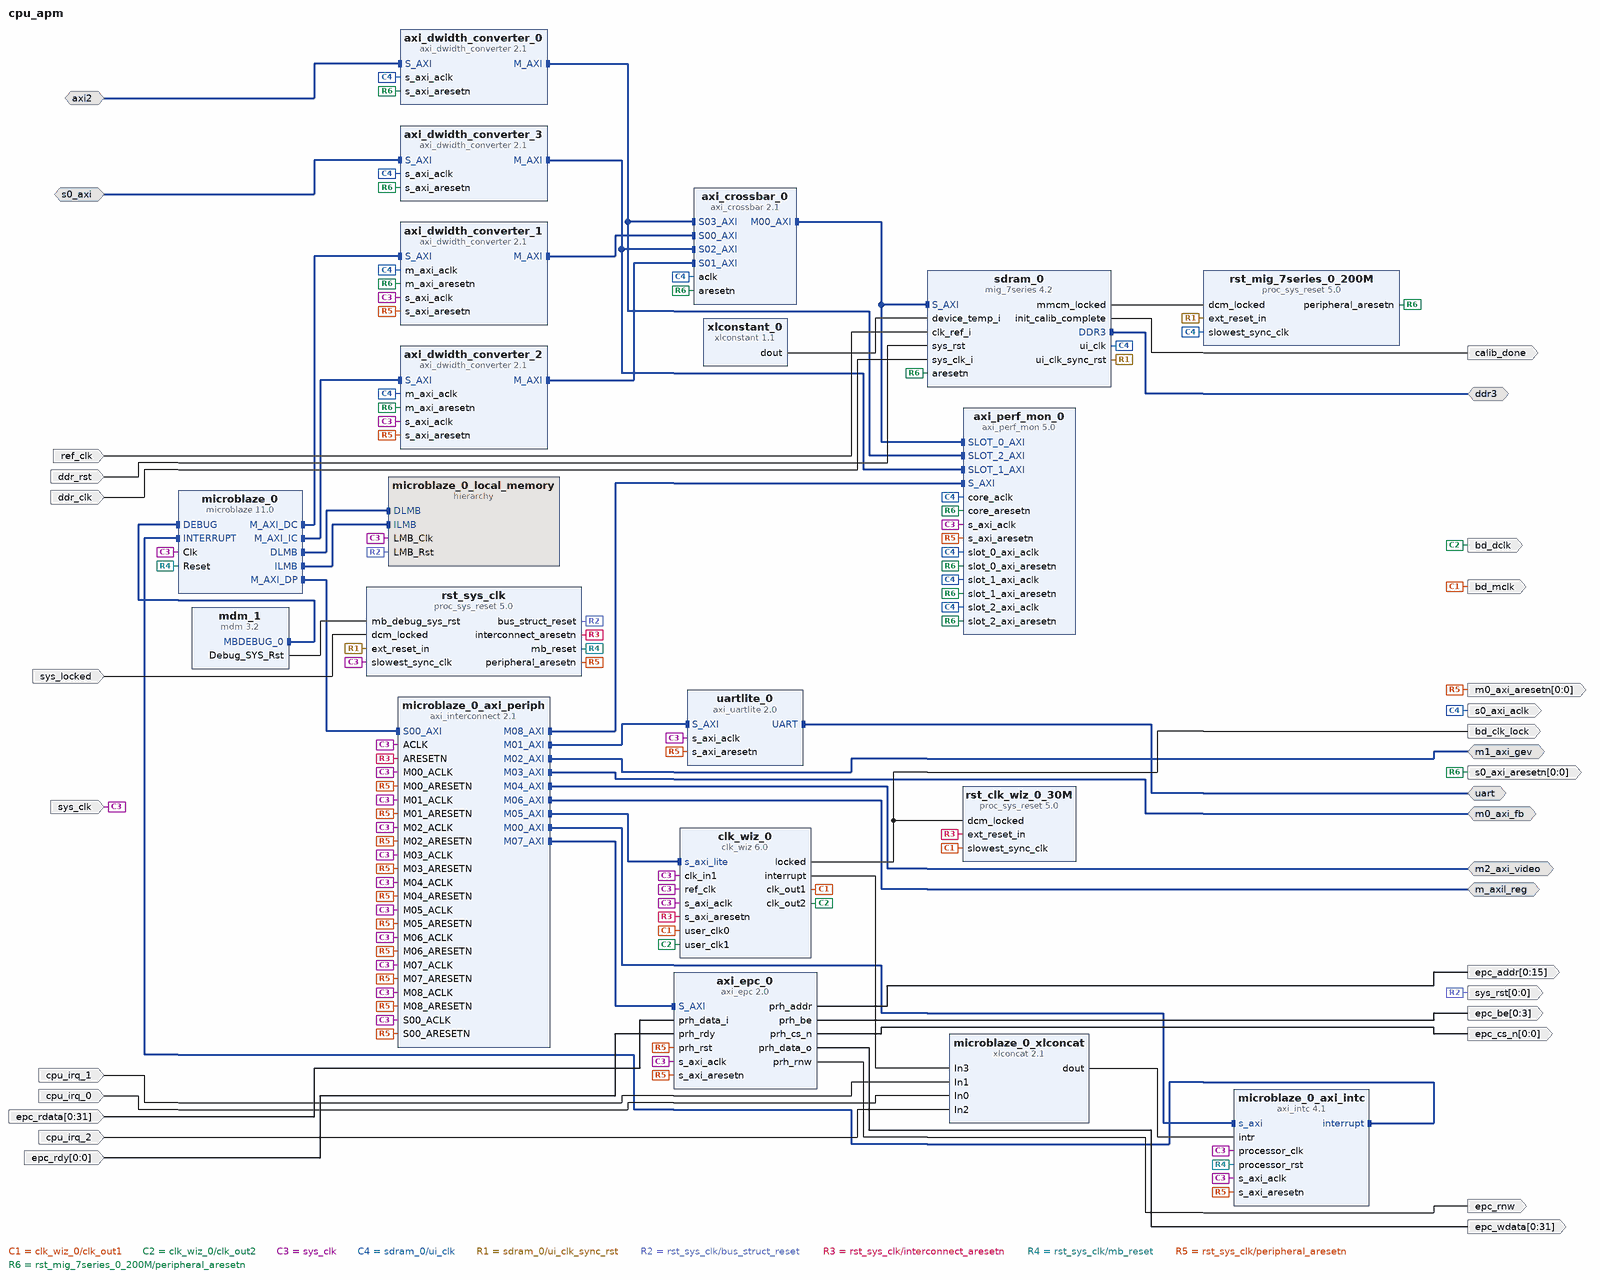
[diagram p0: block diagram of the top level]
# Vivado block design cpu_apm, xc7k160tffg676-3, Vivado 2022.2
create_bd_design cpu_apm

create_bd_intf_port -mode Slave -vlnv xilinx.com:interface:aximm_rtl:1.0 axi2
set_property -dict [list \
  CONFIG.ADDR_WIDTH 32 \
  CONFIG.ARUSER_WIDTH 0 \
  CONFIG.AWUSER_WIDTH 0 \
  CONFIG.BUSER_WIDTH 0 \
  CONFIG.DATA_WIDTH 512 \
  CONFIG.HAS_BRESP 1 \
  CONFIG.HAS_BURST 1 \
  CONFIG.HAS_CACHE 1 \
  CONFIG.HAS_LOCK 1 \
  CONFIG.HAS_PROT 1 \
  CONFIG.HAS_QOS 1 \
  CONFIG.HAS_REGION 1 \
  CONFIG.HAS_RRESP 1 \
  CONFIG.HAS_WSTRB 1 \
  CONFIG.ID_WIDTH 4 \
  CONFIG.MAX_BURST_LENGTH 256 \
  CONFIG.NUM_READ_OUTSTANDING 2 \
  CONFIG.NUM_READ_THREADS 1 \
  CONFIG.NUM_WRITE_OUTSTANDING 2 \
  CONFIG.NUM_WRITE_THREADS 1 \
  CONFIG.PROTOCOL AXI4 \
  CONFIG.READ_WRITE_MODE READ_WRITE \
  CONFIG.RUSER_BITS_PER_BYTE 0 \
  CONFIG.RUSER_WIDTH 0 \
  CONFIG.SUPPORTS_NARROW_BURST 1 \
  CONFIG.WUSER_BITS_PER_BYTE 0 \
  CONFIG.WUSER_WIDTH 0 \
] [get_bd_intf_ports axi2]
create_bd_intf_port -mode Master -vlnv xilinx.com:interface:ddrx_rtl:1.0 ddr3
create_bd_intf_port -mode Master -vlnv xilinx.com:interface:aximm_rtl:1.0 m0_axi_fb
set_property -dict [list \
  CONFIG.ADDR_WIDTH 32 \
  CONFIG.DATA_WIDTH 32 \
  CONFIG.HAS_BURST 0 \
  CONFIG.HAS_CACHE 0 \
  CONFIG.HAS_LOCK 0 \
  CONFIG.HAS_QOS 0 \
  CONFIG.HAS_REGION 0 \
  CONFIG.PROTOCOL AXI4LITE \
] [get_bd_intf_ports m0_axi_fb]
create_bd_intf_port -mode Master -vlnv xilinx.com:interface:aximm_rtl:1.0 m1_axi_gev
set_property -dict [list \
  CONFIG.ADDR_WIDTH 32 \
  CONFIG.DATA_WIDTH 32 \
  CONFIG.HAS_BURST 0 \
  CONFIG.HAS_CACHE 0 \
  CONFIG.HAS_LOCK 0 \
  CONFIG.HAS_QOS 0 \
  CONFIG.HAS_REGION 0 \
  CONFIG.NUM_READ_OUTSTANDING 2 \
  CONFIG.NUM_WRITE_OUTSTANDING 2 \
  CONFIG.PROTOCOL AXI4LITE \
] [get_bd_intf_ports m1_axi_gev]
create_bd_intf_port -mode Master -vlnv xilinx.com:interface:aximm_rtl:1.0 m2_axi_video
set_property -dict [list \
  CONFIG.ADDR_WIDTH 32 \
  CONFIG.DATA_WIDTH 32 \
  CONFIG.HAS_BURST 0 \
  CONFIG.HAS_CACHE 0 \
  CONFIG.HAS_LOCK 0 \
  CONFIG.HAS_QOS 0 \
  CONFIG.HAS_REGION 0 \
  CONFIG.PROTOCOL AXI4LITE \
] [get_bd_intf_ports m2_axi_video]
create_bd_intf_port -mode Master -vlnv xilinx.com:interface:aximm_rtl:1.0 m_axil_reg
set_property -dict [list \
  CONFIG.ADDR_WIDTH 32 \
  CONFIG.DATA_WIDTH 32 \
  CONFIG.HAS_BURST 0 \
  CONFIG.HAS_CACHE 0 \
  CONFIG.HAS_LOCK 0 \
  CONFIG.HAS_QOS 0 \
  CONFIG.HAS_REGION 0 \
  CONFIG.PROTOCOL AXI4LITE \
] [get_bd_intf_ports m_axil_reg]
create_bd_intf_port -mode Slave -vlnv xilinx.com:interface:aximm_rtl:1.0 s0_axi
set_property -dict [list \
  CONFIG.ADDR_WIDTH 32 \
  CONFIG.ARUSER_WIDTH 0 \
  CONFIG.AWUSER_WIDTH 0 \
  CONFIG.BUSER_WIDTH 0 \
  CONFIG.DATA_WIDTH 128 \
  CONFIG.HAS_BRESP 1 \
  CONFIG.HAS_BURST 1 \
  CONFIG.HAS_CACHE 1 \
  CONFIG.HAS_LOCK 1 \
  CONFIG.HAS_PROT 1 \
  CONFIG.HAS_QOS 1 \
  CONFIG.HAS_REGION 1 \
  CONFIG.HAS_RRESP 1 \
  CONFIG.HAS_WSTRB 1 \
  CONFIG.ID_WIDTH 4 \
  CONFIG.MAX_BURST_LENGTH 256 \
  CONFIG.NUM_READ_OUTSTANDING 2 \
  CONFIG.NUM_READ_THREADS 1 \
  CONFIG.NUM_WRITE_OUTSTANDING 2 \
  CONFIG.NUM_WRITE_THREADS 1 \
  CONFIG.PROTOCOL AXI4 \
  CONFIG.READ_WRITE_MODE READ_WRITE \
  CONFIG.RUSER_BITS_PER_BYTE 0 \
  CONFIG.RUSER_WIDTH 0 \
  CONFIG.SUPPORTS_NARROW_BURST 1 \
  CONFIG.WUSER_BITS_PER_BYTE 0 \
  CONFIG.WUSER_WIDTH 0 \
] [get_bd_intf_ports s0_axi]
create_bd_intf_port -mode Master -vlnv xilinx.com:interface:uart_rtl:1.0 uart
create_bd_port -dir O bd_clk_lock
create_bd_port -dir O -type clk bd_dclk
create_bd_port -dir O -type clk bd_mclk
create_bd_port -dir O calib_done
create_bd_port -dir I -type intr cpu_irq_0
create_bd_port -dir I -type intr cpu_irq_1
create_bd_port -dir I -type intr cpu_irq_2
create_bd_port -dir I -type clk ddr_clk
set_property -dict {CONFIG.FREQ_HZ 250000000} [get_bd_ports ddr_clk]
create_bd_port -dir I -type rst ddr_rst
set_property -dict {CONFIG.POLARITY ACTIVE_HIGH} [get_bd_ports ddr_rst]
create_bd_port -dir O -from 0 -to 15 epc_addr
create_bd_port -dir O -from 0 -to 3 epc_be
create_bd_port -dir O -from 0 -to 0 epc_cs_n
create_bd_port -dir I -from 0 -to 31 epc_rdata
create_bd_port -dir I -from 0 -to 0 epc_rdy
create_bd_port -dir O epc_rnw
create_bd_port -dir O -from 0 -to 31 epc_wdata
create_bd_port -dir O -from 0 -to 0 -type rst m0_axi_aresetn
create_bd_port -dir I -type clk ref_clk
create_bd_port -dir O -type clk s0_axi_aclk
set_property -dict {CONFIG.ASSOCIATED_BUSIF axi2:s0_axi CONFIG.ASSOCIATED_RESET s0_axi_aresetn} [get_bd_ports s0_axi_aclk]
create_bd_port -dir O -from 0 -to 0 -type rst s0_axi_aresetn
create_bd_port -dir I -type clk sys_clk
set_property -dict {CONFIG.FREQ_HZ 100000000} [get_bd_ports sys_clk]
create_bd_port -dir I sys_locked
create_bd_port -dir O -from 0 -to 0 -type rst sys_rst

create_bd_cell -type ip -vlnv xilinx.com:ip:axi_crossbar:2.1 axi_crossbar_0
set_property -dict {CONFIG.NUM_MI 1 CONFIG.NUM_SI 4 CONFIG.S03_ARB_PRIORITY 15} [get_bd_cells axi_crossbar_0]
create_bd_cell -type ip -vlnv xilinx.com:ip:axi_dwidth_converter:2.1 axi_dwidth_converter_0
set_property -dict {CONFIG.MI_DATA_WIDTH 256} [get_bd_cells axi_dwidth_converter_0]
create_bd_cell -type ip -vlnv xilinx.com:ip:axi_dwidth_converter:2.1 axi_dwidth_converter_1
set_property -dict {CONFIG.FIFO_MODE 2 CONFIG.MI_DATA_WIDTH 256} [get_bd_cells axi_dwidth_converter_1]
create_bd_cell -type ip -vlnv xilinx.com:ip:axi_dwidth_converter:2.1 axi_dwidth_converter_2
set_property -dict {CONFIG.FIFO_MODE 2 CONFIG.MI_DATA_WIDTH 256} [get_bd_cells axi_dwidth_converter_2]
create_bd_cell -type ip -vlnv xilinx.com:ip:axi_dwidth_converter:2.1 axi_dwidth_converter_3
set_property -dict {CONFIG.MI_DATA_WIDTH 256} [get_bd_cells axi_dwidth_converter_3]
create_bd_cell -type ip -vlnv xilinx.com:ip:axi_epc:2.0 axi_epc_0
set_property -dict [list \
  CONFIG.C_PRH0_AWIDTH 16 \
  CONFIG.C_PRH0_RDY_TOUT 1 \
  CONFIG.C_PRH0_RDY_WIDTH 100000000 \
  CONFIG.C_PRH0_SYNC 1 \
  CONFIG.C_PRH_CLK_PERIOD_PS 10000 \
] [get_bd_cells axi_epc_0]
create_bd_cell -type ip -vlnv xilinx.com:ip:axi_perf_mon:5.0 axi_perf_mon_0
set_property -dict [list \
  CONFIG.C_GLOBAL_COUNT_WIDTH 64 \
  CONFIG.C_NUM_MONITOR_SLOTS 3 \
  CONFIG.C_NUM_OF_COUNTERS 8 \
] [get_bd_cells axi_perf_mon_0]
create_bd_cell -type ip -vlnv xilinx.com:ip:clk_wiz:6.0 clk_wiz_0
set_property -dict [list \
  CONFIG.CLKOUT1_DRIVES BUFGCE \
  CONFIG.CLKOUT1_JITTER 270.092 \
  CONFIG.CLKOUT1_PHASE_ERROR 300.991 \
  CONFIG.CLKOUT1_REQUESTED_OUT_FREQ 30 \
  CONFIG.CLKOUT2_DRIVES BUFGCE \
  CONFIG.CLKOUT2_JITTER 188.083 \
  CONFIG.CLKOUT2_PHASE_ERROR 300.991 \
  CONFIG.CLKOUT2_REQUESTED_OUT_FREQ 360 \
  CONFIG.CLKOUT2_USED true \
  CONFIG.CLKOUT3_DRIVES BUFGCE \
  CONFIG.CLKOUT4_DRIVES BUFGCE \
  CONFIG.CLKOUT5_DRIVES BUFGCE \
  CONFIG.CLKOUT6_DRIVES BUFGCE \
  CONFIG.CLKOUT7_DRIVES BUFGCE \
  CONFIG.ENABLE_CLOCK_MONITOR true \
  CONFIG.ENABLE_USER_CLOCK0 true \
  CONFIG.ENABLE_USER_CLOCK1 true \
  CONFIG.FEEDBACK_SOURCE FDBK_AUTO \
  CONFIG.MMCM_CLKFBOUT_MULT_F 54.000 \
  CONFIG.MMCM_CLKOUT0_DIVIDE_F 36.000 \
  CONFIG.MMCM_CLKOUT1_DIVIDE 3 \
  CONFIG.MMCM_DIVCLK_DIVIDE 5 \
  CONFIG.NUM_OUT_CLKS 2 \
  CONFIG.PRIMITIVE MMCM \
  CONFIG.PRIM_IN_FREQ 100.000 \
  CONFIG.USER_CLK_FREQ0 20 \
  CONFIG.USER_CLK_FREQ1 240 \
  CONFIG.USE_DYN_RECONFIG true \
  CONFIG.USE_SAFE_CLOCK_STARTUP true \
] [get_bd_cells clk_wiz_0]
create_bd_cell -type ip -vlnv xilinx.com:ip:mdm:3.2 mdm_1
create_bd_cell -type ip -vlnv xilinx.com:ip:microblaze:11.0 microblaze_0
set_property -dict [list \
  CONFIG.C_CACHE_BYTE_SIZE 8192 \
  CONFIG.C_DCACHE_BASEADDR 0x0000000080000000 \
  CONFIG.C_DCACHE_BYTE_SIZE 8192 \
  CONFIG.C_DCACHE_HIGHADDR 0x00000000BFFFFFFF \
  CONFIG.C_DEBUG_ENABLED 1 \
  CONFIG.C_D_AXI 1 \
  CONFIG.C_D_LMB 1 \
  CONFIG.C_ICACHE_BASEADDR 0x0000000080000000 \
  CONFIG.C_ICACHE_HIGHADDR 0x00000000BFFFFFFF \
  CONFIG.C_I_LMB 1 \
  CONFIG.C_USE_BARREL 1 \
  CONFIG.C_USE_DCACHE 1 \
  CONFIG.C_USE_DIV 1 \
  CONFIG.C_USE_HW_MUL 1 \
  CONFIG.C_USE_ICACHE 1 \
  CONFIG.C_USE_MSR_INSTR 0 \
  CONFIG.C_USE_PCMP_INSTR 1 \
] [get_bd_cells microblaze_0]
create_bd_cell -type ip -vlnv xilinx.com:ip:axi_intc:4.1 microblaze_0_axi_intc
set_property -dict {CONFIG.C_HAS_FAST 1 CONFIG.C_IRQ_IS_LEVEL 0} [get_bd_cells microblaze_0_axi_intc]
create_bd_cell -type ip -vlnv xilinx.com:ip:axi_interconnect:2.1 microblaze_0_axi_periph
set_property -dict {CONFIG.NUM_MI 9 CONFIG.SYNCHRONIZATION_STAGES 2} [get_bd_cells microblaze_0_axi_periph]
create_bd_cell -type hier microblaze_0_local_memory
create_bd_cell -type ip -vlnv xilinx.com:ip:xlconcat:2.1 microblaze_0_xlconcat
set_property -dict {CONFIG.NUM_PORTS 4} [get_bd_cells microblaze_0_xlconcat]
create_bd_cell -type ip -vlnv xilinx.com:ip:proc_sys_reset:5.0 rst_clk_wiz_0_30M
create_bd_cell -type ip -vlnv xilinx.com:ip:proc_sys_reset:5.0 rst_mig_7series_0_200M
create_bd_cell -type ip -vlnv xilinx.com:ip:proc_sys_reset:5.0 rst_sys_clk
create_bd_cell -type ip -vlnv xilinx.com:ip:mig_7series:4.2 sdram_0
set_property -dict [list \
  CONFIG.BOARD_MIG_PARAM Custom \
  CONFIG.MIG_DONT_TOUCH_PARAM Custom \
  CONFIG.RESET_BOARD_INTERFACE Custom \
  CONFIG.XML_INPUT_FILE mig_a.prj \
] [get_bd_cells sdram_0]
create_bd_cell -type ip -vlnv xilinx.com:ip:axi_uartlite:2.0 uartlite_0
set_property -dict {CONFIG.C_BAUDRATE 115200} [get_bd_cells uartlite_0]
create_bd_cell -type ip -vlnv xilinx.com:ip:xlconstant:1.1 xlconstant_0
set_property -dict {CONFIG.CONST_VAL 0 CONFIG.CONST_WIDTH 12} [get_bd_cells xlconstant_0]

# ---- hierarchy /microblaze_0_local_memory ----
current_bd_instance /microblaze_0_local_memory
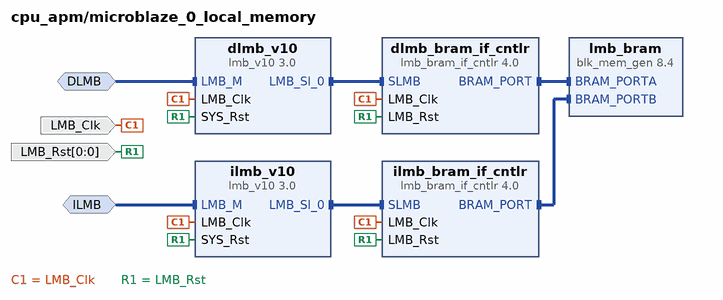
[diagram p1: block diagram inside /microblaze_0_local_memory]
create_bd_intf_pin -mode MirroredMaster -vlnv xilinx.com:interface:lmb_rtl:1.0 DLMB
create_bd_intf_pin -mode MirroredMaster -vlnv xilinx.com:interface:lmb_rtl:1.0 ILMB
create_bd_pin -dir I -type clk LMB_Clk
create_bd_pin -dir I -from 0 -to 0 -type rst LMB_Rst

create_bd_cell -type ip -vlnv xilinx.com:ip:lmb_bram_if_cntlr:4.0 dlmb_bram_if_cntlr
set_property -dict {CONFIG.C_ECC 0} [get_bd_cells dlmb_bram_if_cntlr]
create_bd_cell -type ip -vlnv xilinx.com:ip:lmb_v10:3.0 dlmb_v10
create_bd_cell -type ip -vlnv xilinx.com:ip:lmb_bram_if_cntlr:4.0 ilmb_bram_if_cntlr
set_property -dict {CONFIG.C_ECC 0} [get_bd_cells ilmb_bram_if_cntlr]
create_bd_cell -type ip -vlnv xilinx.com:ip:lmb_v10:3.0 ilmb_v10
create_bd_cell -type ip -vlnv xilinx.com:ip:blk_mem_gen:8.4 lmb_bram
set_property -dict [list \
  CONFIG.EN_SAFETY_CKT false \
  CONFIG.Enable_B Use_ENB_Pin \
  CONFIG.Memory_Type True_Dual_Port_RAM \
  CONFIG.Port_B_Clock 100 \
  CONFIG.Port_B_Enable_Rate 100 \
  CONFIG.Port_B_Write_Rate 50 \
  CONFIG.Use_RSTB_Pin true \
  CONFIG.use_bram_block BRAM_Controller \
] [get_bd_cells lmb_bram]

# ---- connections ----

current_bd_instance /microblaze_0_local_memory
connect_bd_intf_net -intf_net microblaze_0_dlmb [get_bd_intf_pins DLMB] [get_bd_intf_pins dlmb_v10/LMB_M]
connect_bd_intf_net -intf_net microblaze_0_dlmb_bus [get_bd_intf_pins dlmb_bram_if_cntlr/SLMB] [get_bd_intf_pins dlmb_v10/LMB_Sl_0]
connect_bd_intf_net -intf_net microblaze_0_dlmb_cntlr [get_bd_intf_pins dlmb_bram_if_cntlr/BRAM_PORT] [get_bd_intf_pins lmb_bram/BRAM_PORTA]
connect_bd_intf_net -intf_net microblaze_0_ilmb [get_bd_intf_pins ILMB] [get_bd_intf_pins ilmb_v10/LMB_M]
connect_bd_intf_net -intf_net microblaze_0_ilmb_bus [get_bd_intf_pins ilmb_bram_if_cntlr/SLMB] [get_bd_intf_pins ilmb_v10/LMB_Sl_0]
connect_bd_intf_net -intf_net microblaze_0_ilmb_cntlr [get_bd_intf_pins ilmb_bram_if_cntlr/BRAM_PORT] [get_bd_intf_pins lmb_bram/BRAM_PORTB]
connect_bd_net -net microblaze_0_Clk [get_bd_pins LMB_Clk] \
  [get_bd_pins dlmb_bram_if_cntlr/LMB_Clk] [get_bd_pins dlmb_v10/LMB_Clk] [get_bd_pins ilmb_bram_if_cntlr/LMB_Clk] \
  [get_bd_pins ilmb_v10/LMB_Clk]
connect_bd_net -net microblaze_0_LMB_Rst [get_bd_pins LMB_Rst] \
  [get_bd_pins dlmb_bram_if_cntlr/LMB_Rst] [get_bd_pins dlmb_v10/SYS_Rst] [get_bd_pins ilmb_bram_if_cntlr/LMB_Rst] \
  [get_bd_pins ilmb_v10/SYS_Rst]
set_property HDL_ATTRIBUTE.BMM_INFO_ADDRESS_SPACE {byte  0x00000000 32 > cpu_apm microblaze_0_local_memory/lmb_bram} [get_bd_cells dlmb_bram_if_cntlr]
set_property HDL_ATTRIBUTE.KEEP_HIERARCHY yes [get_bd_cells dlmb_bram_if_cntlr]

current_bd_instance /
connect_bd_intf_net -intf_net axi2_1 [get_bd_intf_ports axi2] [get_bd_intf_pins axi_dwidth_converter_0/S_AXI]
connect_bd_intf_net [get_bd_intf_pins axi_crossbar_0/M00_AXI] [get_bd_intf_pins sdram_0/S_AXI]
connect_bd_intf_net [get_bd_intf_pins axi_crossbar_0/M00_AXI] [get_bd_intf_pins axi_perf_mon_0/SLOT_0_AXI]
connect_bd_intf_net [get_bd_intf_pins axi_crossbar_0/S03_AXI] [get_bd_intf_pins axi_dwidth_converter_0/M_AXI]
connect_bd_intf_net [get_bd_intf_pins axi_crossbar_0/S03_AXI] [get_bd_intf_pins axi_perf_mon_0/SLOT_2_AXI]
connect_bd_intf_net [get_bd_intf_pins axi_crossbar_0/S00_AXI] [get_bd_intf_pins axi_dwidth_converter_1/M_AXI]
connect_bd_intf_net [get_bd_intf_pins axi_crossbar_0/S01_AXI] [get_bd_intf_pins axi_dwidth_converter_2/M_AXI]
connect_bd_intf_net [get_bd_intf_pins axi_crossbar_0/S02_AXI] [get_bd_intf_pins axi_dwidth_converter_3/M_AXI]
connect_bd_intf_net [get_bd_intf_pins axi_crossbar_0/S02_AXI] [get_bd_intf_pins axi_perf_mon_0/SLOT_1_AXI]
connect_bd_intf_net [get_bd_intf_pins axi_dwidth_converter_1/S_AXI] [get_bd_intf_pins microblaze_0/M_AXI_DC]
connect_bd_intf_net [get_bd_intf_pins axi_dwidth_converter_2/S_AXI] [get_bd_intf_pins microblaze_0/M_AXI_IC]
connect_bd_intf_net -intf_net microblaze_0_axi_dp [get_bd_intf_pins microblaze_0/M_AXI_DP] [get_bd_intf_pins microblaze_0_axi_periph/S00_AXI]
connect_bd_intf_net [get_bd_intf_pins microblaze_0_axi_periph/M01_AXI] [get_bd_intf_pins uartlite_0/S_AXI]
connect_bd_intf_net [get_bd_intf_ports m1_axi_gev] [get_bd_intf_pins microblaze_0_axi_periph/M02_AXI]
connect_bd_intf_net [get_bd_intf_ports m0_axi_fb] [get_bd_intf_pins microblaze_0_axi_periph/M03_AXI]
connect_bd_intf_net [get_bd_intf_ports m2_axi_video] [get_bd_intf_pins microblaze_0_axi_periph/M04_AXI]
connect_bd_intf_net [get_bd_intf_pins clk_wiz_0/s_axi_lite] [get_bd_intf_pins microblaze_0_axi_periph/M05_AXI]
connect_bd_intf_net [get_bd_intf_ports m_axil_reg] [get_bd_intf_pins microblaze_0_axi_periph/M06_AXI]
connect_bd_intf_net [get_bd_intf_pins axi_epc_0/S_AXI] [get_bd_intf_pins microblaze_0_axi_periph/M07_AXI]
connect_bd_intf_net [get_bd_intf_pins axi_perf_mon_0/S_AXI] [get_bd_intf_pins microblaze_0_axi_periph/M08_AXI]
connect_bd_intf_net [get_bd_intf_pins mdm_1/MBDEBUG_0] [get_bd_intf_pins microblaze_0/DEBUG]
connect_bd_intf_net [get_bd_intf_pins microblaze_0/DLMB] [get_bd_intf_pins microblaze_0_local_memory/DLMB]
connect_bd_intf_net [get_bd_intf_pins microblaze_0/ILMB] [get_bd_intf_pins microblaze_0_local_memory/ILMB]
connect_bd_intf_net -intf_net microblaze_0_intc_axi [get_bd_intf_pins microblaze_0_axi_intc/s_axi] [get_bd_intf_pins microblaze_0_axi_periph/M00_AXI]
connect_bd_intf_net [get_bd_intf_pins microblaze_0/INTERRUPT] [get_bd_intf_pins microblaze_0_axi_intc/interrupt]
connect_bd_intf_net [get_bd_intf_ports s0_axi] [get_bd_intf_pins axi_dwidth_converter_3/S_AXI]
connect_bd_intf_net [get_bd_intf_ports ddr3] [get_bd_intf_pins sdram_0/DDR3]
connect_bd_intf_net [get_bd_intf_ports uart] [get_bd_intf_pins uartlite_0/UART]
connect_bd_net [get_bd_pins axi_epc_0/prh_addr] [get_bd_ports epc_addr]
connect_bd_net [get_bd_pins axi_epc_0/prh_be] [get_bd_ports epc_be]
connect_bd_net [get_bd_pins axi_epc_0/prh_cs_n] [get_bd_ports epc_cs_n]
connect_bd_net [get_bd_pins axi_epc_0/prh_data_o] [get_bd_ports epc_wdata]
connect_bd_net [get_bd_pins axi_epc_0/prh_rnw] [get_bd_ports epc_rnw]
connect_bd_net -net clk_ref_i_0_1 [get_bd_ports ref_clk] [get_bd_pins sdram_0/clk_ref_i]
connect_bd_net [get_bd_pins clk_wiz_0/clk_out1] \
  [get_bd_ports bd_mclk] [get_bd_pins clk_wiz_0/user_clk0] [get_bd_pins rst_clk_wiz_0_30M/slowest_sync_clk]
connect_bd_net [get_bd_pins clk_wiz_0/clk_out2] [get_bd_ports bd_dclk] [get_bd_pins clk_wiz_0/user_clk1]
connect_bd_net [get_bd_pins clk_wiz_0/interrupt] [get_bd_pins microblaze_0_xlconcat/In3]
connect_bd_net [get_bd_pins clk_wiz_0/locked] [get_bd_ports bd_clk_lock] [get_bd_pins rst_clk_wiz_0_30M/dcm_locked]
connect_bd_net -net dcm_locked_0_1 [get_bd_ports sys_locked] [get_bd_pins rst_sys_clk/dcm_locked]
connect_bd_net -net irq_fb_1 [get_bd_ports cpu_irq_1] [get_bd_pins microblaze_0_xlconcat/In1]
connect_bd_net -net irq_gige_1 [get_bd_ports cpu_irq_0] [get_bd_pins microblaze_0_xlconcat/In0]
connect_bd_net -net irq_mac_1 [get_bd_ports cpu_irq_2] [get_bd_pins microblaze_0_xlconcat/In2]
connect_bd_net [get_bd_pins mdm_1/Debug_SYS_Rst] [get_bd_pins rst_sys_clk/mb_debug_sys_rst]
connect_bd_net -net microblaze_0_Clk [get_bd_ports sys_clk] \
  [get_bd_pins axi_dwidth_converter_1/s_axi_aclk] [get_bd_pins axi_dwidth_converter_2/s_axi_aclk] \
  [get_bd_pins axi_epc_0/s_axi_aclk] [get_bd_pins axi_perf_mon_0/s_axi_aclk] [get_bd_pins clk_wiz_0/clk_in1] \
  [get_bd_pins clk_wiz_0/ref_clk] [get_bd_pins clk_wiz_0/s_axi_aclk] [get_bd_pins microblaze_0/Clk] \
  [get_bd_pins microblaze_0_axi_intc/processor_clk] [get_bd_pins microblaze_0_axi_intc/s_axi_aclk] \
  [get_bd_pins microblaze_0_axi_periph/ACLK] [get_bd_pins microblaze_0_axi_periph/M00_ACLK] \
  [get_bd_pins microblaze_0_axi_periph/M01_ACLK] [get_bd_pins microblaze_0_axi_periph/M02_ACLK] \
  [get_bd_pins microblaze_0_axi_periph/M03_ACLK] [get_bd_pins microblaze_0_axi_periph/M04_ACLK] \
  [get_bd_pins microblaze_0_axi_periph/M05_ACLK] [get_bd_pins microblaze_0_axi_periph/M06_ACLK] \
  [get_bd_pins microblaze_0_axi_periph/M07_ACLK] [get_bd_pins microblaze_0_axi_periph/M08_ACLK] \
  [get_bd_pins microblaze_0_axi_periph/S00_ACLK] [get_bd_pins microblaze_0_local_memory/LMB_Clk] \
  [get_bd_pins rst_sys_clk/slowest_sync_clk] [get_bd_pins uartlite_0/s_axi_aclk]
connect_bd_net -net microblaze_0_intr [get_bd_pins microblaze_0_xlconcat/dout] [get_bd_pins microblaze_0_axi_intc/intr]
connect_bd_net -net mig_7series_0_mmcm_locked [get_bd_pins sdram_0/mmcm_locked] [get_bd_pins rst_mig_7series_0_200M/dcm_locked]
connect_bd_net -net mig_7series_0_ui_clk [get_bd_pins sdram_0/ui_clk] \
  [get_bd_ports s0_axi_aclk] [get_bd_pins axi_crossbar_0/aclk] [get_bd_pins axi_dwidth_converter_0/s_axi_aclk] \
  [get_bd_pins axi_dwidth_converter_1/m_axi_aclk] [get_bd_pins axi_dwidth_converter_2/m_axi_aclk] \
  [get_bd_pins axi_dwidth_converter_3/s_axi_aclk] [get_bd_pins axi_perf_mon_0/core_aclk] \
  [get_bd_pins axi_perf_mon_0/slot_0_axi_aclk] [get_bd_pins axi_perf_mon_0/slot_1_axi_aclk] \
  [get_bd_pins axi_perf_mon_0/slot_2_axi_aclk] [get_bd_pins rst_mig_7series_0_200M/slowest_sync_clk]
connect_bd_net -net mig_7series_0_ui_clk_sync_rst [get_bd_pins sdram_0/ui_clk_sync_rst] \
  [get_bd_pins rst_mig_7series_0_200M/ext_reset_in] [get_bd_pins rst_sys_clk/ext_reset_in]
connect_bd_net -net prh_data_i_0_1 [get_bd_ports epc_rdata] [get_bd_pins axi_epc_0/prh_data_i]
connect_bd_net -net prh_rdy_0_1 [get_bd_ports epc_rdy] [get_bd_pins axi_epc_0/prh_rdy]
connect_bd_net -net reset_1 [get_bd_ports ddr_rst] [get_bd_pins sdram_0/sys_rst]
connect_bd_net -net rst_clk_wiz_1_100M_bus_struct_reset [get_bd_pins rst_sys_clk/bus_struct_reset] \
  [get_bd_ports sys_rst] [get_bd_pins microblaze_0_local_memory/LMB_Rst]
connect_bd_net -net rst_clk_wiz_1_100M_interconnect_aresetn [get_bd_pins rst_sys_clk/interconnect_aresetn] \
  [get_bd_pins clk_wiz_0/s_axi_aresetn] [get_bd_pins microblaze_0_axi_periph/ARESETN] \
  [get_bd_pins rst_clk_wiz_0_30M/ext_reset_in]
connect_bd_net -net rst_clk_wiz_1_100M_mb_reset [get_bd_pins rst_sys_clk/mb_reset] \
  [get_bd_pins microblaze_0/Reset] [get_bd_pins microblaze_0_axi_intc/processor_rst]
connect_bd_net -net rst_clk_wiz_1_100M_peripheral_aresetn [get_bd_pins rst_sys_clk/peripheral_aresetn] \
  [get_bd_ports m0_axi_aresetn] [get_bd_pins axi_dwidth_converter_1/s_axi_aresetn] \
  [get_bd_pins axi_dwidth_converter_2/s_axi_aresetn] [get_bd_pins axi_epc_0/prh_rst] [get_bd_pins axi_epc_0/s_axi_aresetn] \
  [get_bd_pins axi_perf_mon_0/s_axi_aresetn] [get_bd_pins microblaze_0_axi_intc/s_axi_aresetn] \
  [get_bd_pins microblaze_0_axi_periph/M00_ARESETN] [get_bd_pins microblaze_0_axi_periph/M01_ARESETN] \
  [get_bd_pins microblaze_0_axi_periph/M02_ARESETN] [get_bd_pins microblaze_0_axi_periph/M03_ARESETN] \
  [get_bd_pins microblaze_0_axi_periph/M04_ARESETN] [get_bd_pins microblaze_0_axi_periph/M05_ARESETN] \
  [get_bd_pins microblaze_0_axi_periph/M06_ARESETN] [get_bd_pins microblaze_0_axi_periph/M07_ARESETN] \
  [get_bd_pins microblaze_0_axi_periph/M08_ARESETN] [get_bd_pins microblaze_0_axi_periph/S00_ARESETN] \
  [get_bd_pins uartlite_0/s_axi_aresetn]
connect_bd_net [get_bd_pins rst_mig_7series_0_200M/peripheral_aresetn] \
  [get_bd_ports s0_axi_aresetn] [get_bd_pins axi_crossbar_0/aresetn] [get_bd_pins axi_dwidth_converter_0/s_axi_aresetn] \
  [get_bd_pins axi_dwidth_converter_1/m_axi_aresetn] [get_bd_pins axi_dwidth_converter_2/m_axi_aresetn] \
  [get_bd_pins axi_dwidth_converter_3/s_axi_aresetn] [get_bd_pins axi_perf_mon_0/core_aresetn] \
  [get_bd_pins axi_perf_mon_0/slot_0_axi_aresetn] [get_bd_pins axi_perf_mon_0/slot_1_axi_aresetn] \
  [get_bd_pins axi_perf_mon_0/slot_2_axi_aresetn] [get_bd_pins sdram_0/aresetn]
connect_bd_net [get_bd_pins sdram_0/init_calib_complete] [get_bd_ports calib_done]
connect_bd_net -net sys_clk_i_0_1 [get_bd_ports ddr_clk] [get_bd_pins sdram_0/sys_clk_i]
connect_bd_net [get_bd_pins xlconstant_0/dout] [get_bd_pins sdram_0/device_temp_i]
set_property HDL_ATTRIBUTE.BMM_INFO_PROCESSOR {microblaze-le > cpu_apm microblaze_0_local_memory/dlmb_bram_if_cntlr} [get_bd_cells microblaze_0]
set_property HDL_ATTRIBUTE.KEEP_HIERARCHY yes [get_bd_cells microblaze_0]

# ---- address map ----
assign_bd_address -offset 0x80000000 -range 1G -target_address_space [get_bd_addr_spaces axi2] [get_bd_addr_segs sdram_0/memmap/memaddr]
assign_bd_address -offset 0x00000000 -range 16K -target_address_space [get_bd_addr_spaces microblaze_0/Data] [get_bd_addr_segs microblaze_0_local_memory/dlmb_bram_if_cntlr/SLMB/Mem]
assign_bd_address -offset 0x40600000 -range 64K -target_address_space [get_bd_addr_spaces microblaze_0/Data] [get_bd_addr_segs uartlite_0/S_AXI/Reg]
assign_bd_address -offset 0x41200000 -range 64K -target_address_space [get_bd_addr_spaces microblaze_0/Data] [get_bd_addr_segs microblaze_0_axi_intc/S_AXI/Reg]
assign_bd_address -offset 0x43E00000 -range 64K -target_address_space [get_bd_addr_spaces microblaze_0/Data] [get_bd_addr_segs axi_epc_0/S_AXI_MEM/PRH0]
assign_bd_address -offset 0x44A00000 -range 64K -target_address_space [get_bd_addr_spaces microblaze_0/Data] [get_bd_addr_segs m0_axi_fb/Reg]
assign_bd_address -offset 0x44A10000 -range 64K -target_address_space [get_bd_addr_spaces microblaze_0/Data] [get_bd_addr_segs m1_axi_gev/Reg]
assign_bd_address -offset 0x44A20000 -range 64K -target_address_space [get_bd_addr_spaces microblaze_0/Data] [get_bd_addr_segs m2_axi_video/Reg]
assign_bd_address -offset 0x44A30000 -range 64K -target_address_space [get_bd_addr_spaces microblaze_0/Data] [get_bd_addr_segs clk_wiz_0/s_axi_lite/Reg]
assign_bd_address -offset 0x44A40000 -range 64K -target_address_space [get_bd_addr_spaces microblaze_0/Data] [get_bd_addr_segs m_axil_reg/Reg]
assign_bd_address -offset 0x44A50000 -range 64K -target_address_space [get_bd_addr_spaces microblaze_0/Data] [get_bd_addr_segs axi_perf_mon_0/S_AXI/Reg]
assign_bd_address -offset 0x80000000 -range 1G -target_address_space [get_bd_addr_spaces microblaze_0/Data] [get_bd_addr_segs sdram_0/memmap/memaddr]
assign_bd_address -offset 0x00000000 -range 16K -target_address_space [get_bd_addr_spaces microblaze_0/Instruction] [get_bd_addr_segs microblaze_0_local_memory/ilmb_bram_if_cntlr/SLMB/Mem]
assign_bd_address -offset 0x80000000 -range 1G -target_address_space [get_bd_addr_spaces microblaze_0/Instruction] [get_bd_addr_segs sdram_0/memmap/memaddr]
assign_bd_address -offset 0x80000000 -range 1G -target_address_space [get_bd_addr_spaces s0_axi] [get_bd_addr_segs sdram_0/memmap/memaddr]

validate_bd_design
save_bd_design
